# Altium project CornerBreakouts.PrjPcb
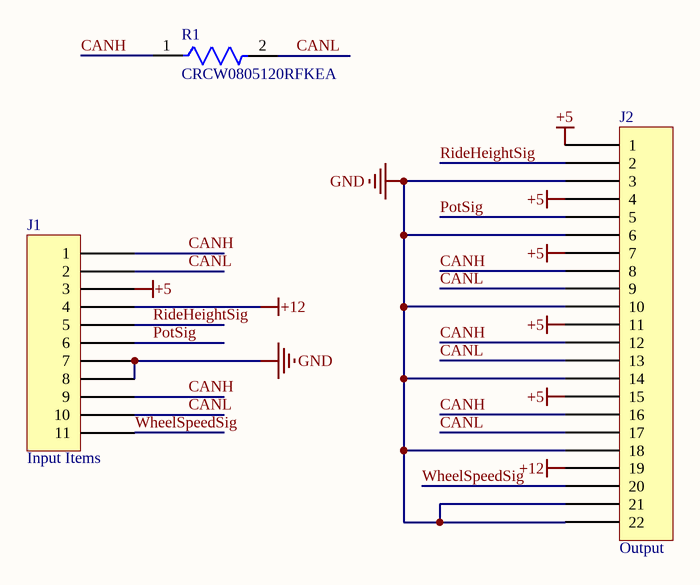
[diagram p0: Breakout.SchDoc]
1 sheet, 3 parts. Net scope: global (net labels, ports and power ports of the same name join across sheets).
Board file: BreakoutPcbDoc.PcbDoc

## Sheet Breakout.SchDoc
size A; SheetNumber: 1; SheetTotal: 1

### Parts
J1  Input Items  [Input]
J2  Output  [Output]
R1  CRCW0805120RFKEA  [FP-CRCW0805-e3-IPC_C]

### Nets
+5: J1.3 J2.1 J2.4 J2.7 J2.11 J2.15
+12: J1.4 J2.19
GND: J1.7 J1.8 J2.3 J2.6 J2.10 J2.14 J2.18 J2.21 J2.22
CANH: J1.1 J1.9 J2.8 J2.12 J2.16 R1.1
CANL: J1.2 J1.10 J2.9 J2.13 J2.17 R1.2
PotSig: J1.6 J2.5
RideHeightSig: J1.5 J2.2
WheelSpeedSig: J1.11 J2.20

### Library data of the parts
J1 = Input
R1 = CMP-02407-007854-1: RES Thick Film, 120Ω, 1%, 0.125W, 100ppm/°C, 0805; Resistance: 120R; Voltage Rating (DC): 150V; Max Power Dissipation: 125mW; Height: 0.45mm; Min Operating Temperature: -55°C; Packaging: Tape and Reel; Package Quantity: 10; Width: 1.25mm; Weight: 0.000194oz; Termination: SMD/SMT; Mount: Surface Mount; Tolerance: 1%; Military Standard: Not; Max Operating Temperature: 155°C; Lead Free: Lead Free; Number of Terminations: 2; Radiation Hardening: No; Temperature Coefficient: 100ppm/°C; Length: 2mm; Case/Package: 0805; Voltage Rating: 150V; Case Code (Metric): 2012; Case Code (Imperial): 0805; Features: Automotive AEC-Q200; Composition: Thick Film; Contact Plating: Tin; Power Rating: 125mW; Depth: 1.25mm